# EAGLE schematic Mesh (EAGLE 9.5.1)

## Sheet 1 of 4
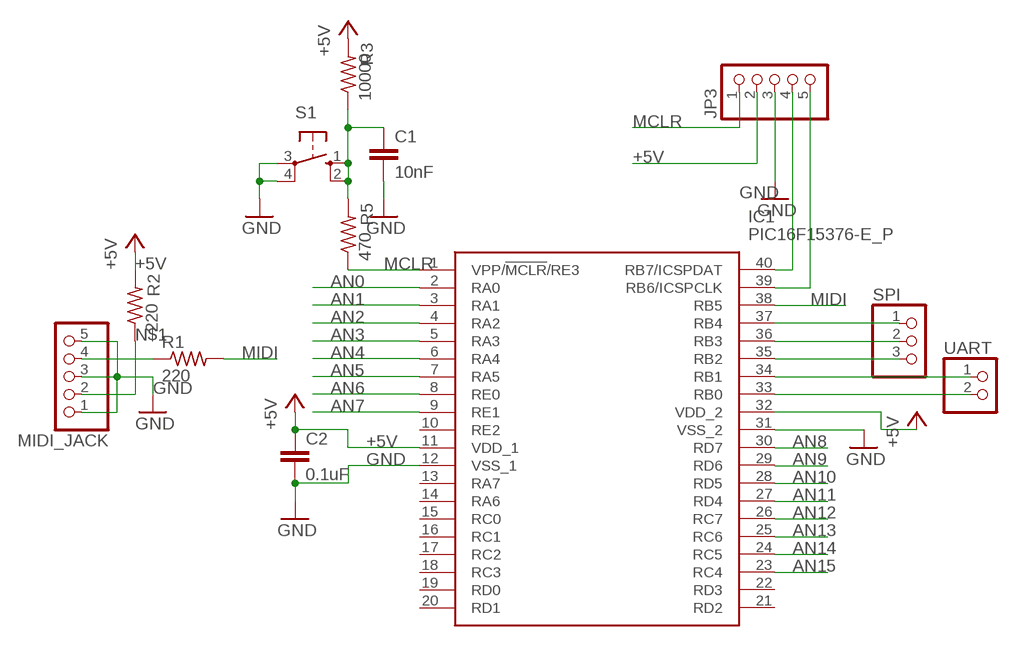
[diagram p0: schematic, sheet 1]

### Parts
C1  10nF  C-EUC0603  [C0603]
C2  0.1uF  C-EUC0603  [C0603]
IC1  PIC16F15376-E_P  [DIP1543W58P254L5175H635Q40N]
JP3  PINHD-1X5  [1X05]
MIDI_JACK  PINHD-1X5  [1X05]
R1  220  R-US_R0603  [R0603]
R2  220  R-US_R0603  [R0603]
R3  10000  R-US_R0603  [R0603]
R5  470  R-US_R0603  [R0603]
S1  10-XX  [B3F-10XX]
SPI  PINHD-1X3  [1X03]
UART  PINHD-1X2  [1X02]

### Nets
+5V: C2.1 IC1.11(VDD_1) IC1.32(VDD_2) JP3.2 R2.2 R3.2 ; also sheet 3
AN0: IC1.2(RA0) ; also sheet 2
AN1: IC1.3(RA1) ; also sheet 2
AN2: IC1.4(RA2) ; also sheet 2
AN3: IC1.5(RA3) ; also sheet 2
AN4: IC1.6(RA4) ; also sheet 2
AN5: IC1.7(RA5) ; also sheet 2
AN6: IC1.8(RE0) ; also sheet 2
AN7: IC1.9(RE1) ; also sheet 2
AN8: IC1.30(RD7) ; also sheet 2
AN9: IC1.29(RD6) ; also sheet 2
AN10: IC1.28(RD5) ; also sheet 2
AN11: IC1.27(RD4) ; also sheet 2
AN12: IC1.26(RC7) ; also sheet 2
AN13: IC1.25(RC6) ; also sheet 2
AN14: IC1.24(RC5) ; also sheet 2
AN15: IC1.23(RC4) ; also sheet 2
GND: C1.2 C2.2 IC1.12(VSS_1) IC1.31(VSS_2) JP3.3 MIDI_JACK.1 MIDI_JACK.3 MIDI_JACK.5 S1.3(P) S1.4(P1) ; also sheet 2,3
MCLR: C1.1 IC1.1(VPP/!MCLR!/RE3) JP3.1 R3.1 R5.1 R5.2 S1.1(S) S1.2(S1)
MIDI: IC1.38(RB5) R1.2
N$1: MIDI_JACK.2 R2.1
N$2: IC1.33(RB0) UART.2
N$3: IC1.34(RB1) UART.1
N$4: IC1.35(RB2) SPI.3
N$5: MIDI_JACK.4 R1.1
N$6: IC1.36(RB3) SPI.2
N$7: IC1.37(RB4) SPI.1
N$10: IC1.40(RB7/ICSPDAT) JP3.4
N$11: IC1.39(RB6/ICSPCLK) JP3.5
Unconnected: IC1.10(RE2) IC1.13(RA7) IC1.14(RA6) IC1.15(RC0) IC1.16(RC1) IC1.17(RC2) IC1.18(RC3) IC1.19(RD0) IC1.20(RD1) IC1.21(RD2) IC1.22(RD3)

## Sheet 2 of 4
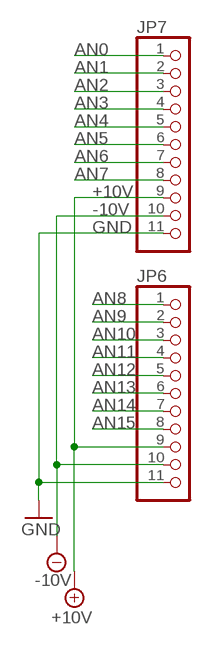
[diagram p1: schematic, sheet 2]

### Parts
JP6  PINHD-1X11/90  [1X11/90]
JP7  PINHD-1X11/90  [1X11/90]

### Nets
+10V: JP6.9 JP7.9 ; also sheet 3
-10V: JP6.10 JP7.10
AN0: JP7.1 ; also sheet 1
AN1: JP7.2 ; also sheet 1
AN2: JP7.3 ; also sheet 1
AN3: JP7.4 ; also sheet 1
AN4: JP7.5 ; also sheet 1
AN5: JP7.6 ; also sheet 1
AN6: JP7.7 ; also sheet 1
AN7: JP7.8 ; also sheet 1
AN8: JP6.1 ; also sheet 1
AN9: JP6.2 ; also sheet 1
AN10: JP6.3 ; also sheet 1
AN11: JP6.4 ; also sheet 1
AN12: JP6.5 ; also sheet 1
AN13: JP6.6 ; also sheet 1
AN14: JP6.7 ; also sheet 1
AN15: JP6.8 ; also sheet 1
GND: JP6.11 JP7.11 ; also sheet 1,3

## Sheet 3 of 4
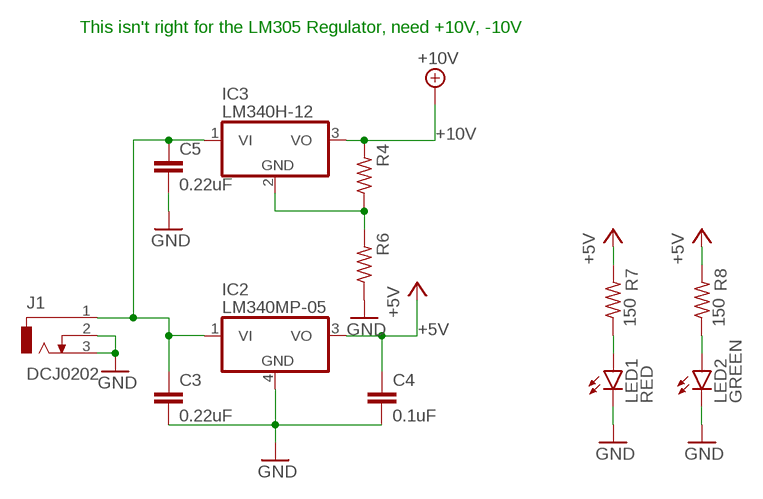
[diagram p2: schematic, sheet 3]

### Parts
C3  0.22uF  C-EUC0603  [C0603]
C4  0.1uF  C-EUC0603  [C0603]
C5  0.22uF  C-EUC0603  [C0603]
IC2  LM340MP-05  [SOT223]
IC3  LM340H-12  [TO220H]
J1  DCJ0202  [DCJ0202]
LED1  RED  LEDCHIP-LED0603  [CHIP-LED0603]
LED2  GREEN  LEDCHIP-LED0603  [CHIP-LED0603]
R4  R-US_R0603  [R0603]
R6  R-US_R0603  [R0603]
R7  150  R-US_R0603  [R0603]
R8  150  R-US_R0603  [R0603]

### Nets
+5V: C4.1 IC2.3(VO) R7.2 R8.2 ; also sheet 1
+10V: IC3.3(VO) R4.2 ; also sheet 2
GND: C3.2 C4.2 C5.2 IC2.4(GND) J1.2 J1.3 LED1.C LED2.C R6.1 ; also sheet 1,2
N$8: IC3.2(GND) R4.1 R6.2
N$9: C3.1 C5.1 IC2.1(VI) IC3.1(VI) J1.1
N$12: LED1.A R7.1
N$13: LED2.A R8.1

### Notes on the sheet
- This isn't right for the LM305 Regulator, need +10V, -10V

## Sheet 4 of 4
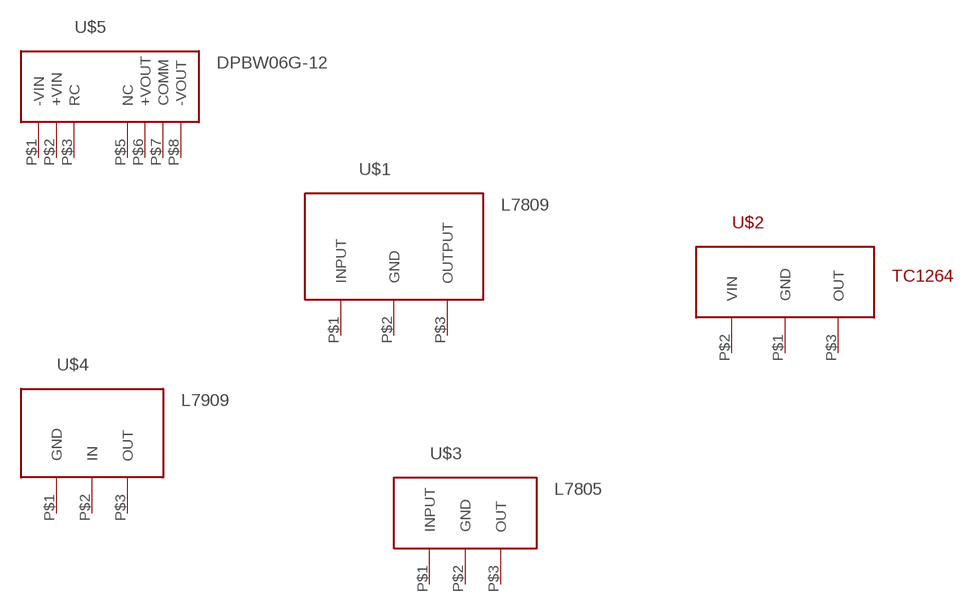
[diagram p3: schematic, sheet 4]

### Parts
U$1  L7809  [L7809]
U$2  TC1264  [TC1264]
U$3  L7805  [L7805]
U$4  L7909  [L7909]
U$5  DPBW06G-12  [DPBW06G-12]
Unconnected: U$1.P$1(INPUT) U$1.P$2(GND) U$1.P$3(OUTPUT) U$2.P$1(GND) U$2.P$2(VIN) U$2.P$3(OUT) U$3.P$1(INPUT) U$3.P$2(GND) U$3.P$3(OUT) U$4.P$1(GND) U$4.P$2(IN) U$4.P$3(OUT) U$5.P$1(-VIN) U$5.P$2(+VIN) U$5.P$3(RC) U$5.P$5(NC) U$5.P$6(+VOUT) U$5.P$7(COMM) U$5.P$8(-VOUT)

## Library data of the parts
C1-C5 = rcl:C-EU: CAPACITOR, European symbol; SPICEPREFIX: C
IC1 = PIC16F15376-E_P:PIC16F15376-E_P: 8-bit Microcontrollers - MCU 28KB, 2KB RAM, 4xPWMs, Comparator, DAC, ADC, CWG, 4xCLC, 2 EUSART, SPI/I2C Source: Datasheet <http://ww1.microchip.com/downloads/en/DeviceDoc/PIC16LF15356-75-76-85-86-Data Sheet-40001866B.pdf>; DESCRIPTION: 8-bit Microcontrollers - MCU 28KB, 2KB RAM, 4xPWMs, Comparator, DAC, ADC, CWG, 4xCLC, 2 EUSART, SPI/I2C; HEIGHT: 6.35mm; MANUFACTURER_NAME: Microchip; MANUFACTURER_PART_NUMBER: PIC16F15376-E/P; MOUSER_PART_NUMBER: 579-PIC16F15376-E/P; MOUSER_PRICE-STOCK: https://www.mouser.com/Search/Refine.aspx?Keyword=579-PIC16F15376-E%2FP
IC2 IC3 = linear:LM340?-*: Positive VOLTAGE REGULATOR Source: http://cache.national.com/ds/LM/LM340.pdf
J1 = con-jack:DCJ0202: DC POWER JACK Source: DCJ0202.pdf; OC_FARNELL: unknown; OC_NEWARK: unknown
JP3 MIDI_JACK = pinhead:PINHD-1X5: PIN HEADER
JP6 JP7 = pinhead:PINHD-1X11: PIN HEADER
LED1 LED2 = led:LED: LED OSRAM: - CHIPLED LG R971, LG N971, LY N971, LG Q971, LY Q971, LO R971, LY R971 LH N974, LH R974 LS Q976, LO Q976, LY Q976 LO Q996 - Hyper CHIPLED LW Q18S LB Q993, LB Q99A, LB R99A - SideLED LS A670, LO A670, LY A670, LG A670, LP A670 LB A673, LV A673, LT A673, LW A673 LH A674 LY A675 LS A676, LA A676, LO A676, LY A676, LW A676 LS A679, LY A679, LG A679 - Hyper Micro SIDELED® LS Y876, LA Y876, LO Y876, LY Y876 LT Y87S - SmartLED LW L88C, LW L88S LB L89C, LB L89S, LG L890 LS L89K, LO L89K, LY L89K LS L896, LA L896, LO L896, LY L896 - TOPLED LS T670, LO T670, LY T670, LG T670, LP T670 LSG T670, LSP T670, LSY T670, LOP T670, LYG T670 LG T671, LOG T671, LSG T671 LB T673, LV T673, LT T673, LW T673 LH T674 LS T676, LA T676, LO T676, LY T676, LB T676, LH T676, LSB T676, LW T676 LB T67C, LV T67C, LT T67C, LS T67K, LO T67K, LY T67K, LW E67C LS E67B, LA E67B, LO E67B, LY E67B, LB E67C, LV E67C, LT E67C LW T67C LS T679, LY T679, LG T679 LS T770, LO T770, LY T770, LG T770, LP T770 LB T773, LV T773, LT T773, LW T773 LH T774 LS E675, LA E675, LY E675, LS T675 LS T776, LA T776, LO T776, LY T776, LB T776 LHGB T686 LT T68C, LB T68C - Hyper Mini TOPLED® LB M676 - Mini TOPLED Santana® LG M470 LS M47K, LO M47K, LY M47K Source: http://www.osram.convergy.de LUXEON: - LUMILED® LXK2-PW12-R00, LXK2-PW12-S00, LXK2-PW14-U00, LXK2-PW14-V00 LXK2-PM12-R00, LXK2-PM12-S00, LXK2-PM14-U00 LXK2-PE12-Q00, LXK2-PE12-R00, LXK2-PE12-S00, LXK2-PE14-T00, LXK2-PE14-U00 LXK2-PB12-K00, LXK2-PB12-L00, LXK2-PB12-M00, LXK2-PB14-N00, LXK2-PB14-P00, LXK2-PB14-Q00 LXK2-PR12-L00, LXK2-PR12-M00, LXK2-PR14-Q00, LXK2-PR14-R00 LXK2-PD12-Q00, LXK2-PD12-R00, LXK2-PD12-S00 LXK2-PH12-R00, LXK2-PH12-S00 LXK2-PL12-P00, LXK2-PL12-Q00, LXK2-PL12-R00 Source: www.luxeon.com KINGBRIGHT: KA-3528ASYC Source: www.kingbright.com
R1-R8 = rcl:R-US_: RESISTOR, American symbol; SPICEPREFIX: R
S1 = switch-omron:10-XX: OMRON SWITCH; MPN: B3F-1000; OC_FARNELL: 176432; OC_NEWARK: 36M3542
SPI = pinhead:PINHD-1X3: PIN HEADER
U$1 = MeshPCB:L7809
U$2 = MeshPCB:TC1264
U$3 = MeshPCB:L7805
U$4 = MeshPCB:L7909
U$5 = MeshPCB:DPBW06G-12
UART = pinhead:PINHD-1X2: PIN HEADER